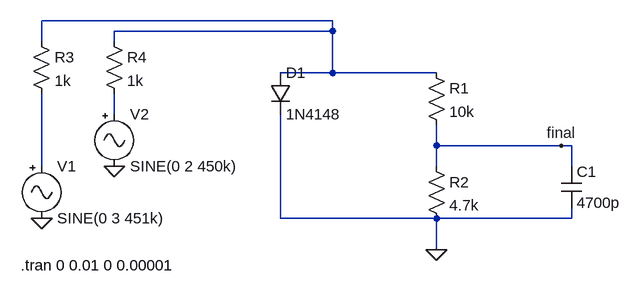
[diagram p0: schematic Draft2.asc]
Draft2.asc, the LTspice schematic file:
Version 4
SHEET 1 880 680
WIRE 80 16 -368 16
WIRE 80 32 80 16
WIRE 80 32 -256 32
WIRE -368 48 -368 16
WIRE -256 48 -256 32
WIRE 80 96 80 32
WIRE 80 96 0 96
WIRE 240 96 80 96
WIRE -256 160 -256 128
WIRE 240 208 240 176
WIRE 432 208 240 208
WIRE 448 208 432 208
WIRE -368 240 -368 128
WIRE 240 240 240 208
WIRE 448 240 448 208
WIRE 0 320 0 160
WIRE 240 320 0 320
WIRE 448 320 448 304
WIRE 448 320 240 320
WIRE 240 368 240 320
FLAG 240 368 0
FLAG 432 208 final
FLAG -368 320 0
FLAG -256 240 0
SYMBOL diode -16 96 R0
SYMATTR InstName D1
SYMATTR Value 1N4148
SYMBOL res 224 80 R0
SYMATTR InstName R1
SYMATTR Value 10k
SYMBOL res 224 224 R0
SYMATTR InstName R2
SYMATTR Value 4.7k
SYMBOL cap 432 240 R0
SYMATTR InstName C1
SYMATTR Value 4700p
SYMBOL Misc\\signal -368 224 R0
WINDOW 123 0 0 Left 0
WINDOW 39 0 0 Left 0
SYMATTR InstName V1
SYMATTR Value SINE(0 3 451k)
SYMBOL Misc\\signal -256 144 R0
WINDOW 123 0 0 Left 0
WINDOW 39 0 0 Left 0
SYMATTR InstName V2
SYMATTR Value SINE(0 2 450k)
SYMBOL res -384 32 R0
SYMATTR InstName R3
SYMATTR Value 1k
SYMBOL res -272 32 R0
SYMATTR InstName R4
SYMATTR Value 1k
TEXT -400 392 Left 2 !.tran 0 0.01 0 0.00001

The netlist it stands for:
* Draft2.asc
D1 N001 0 1N4148
R1 N001 final 10k
R2 final 0 4.7k
C1 final 0 4700p
V1 N003 0 SINE(0 3 451k)
V2 N002 0 SINE(0 2 450k)
R3 N001 N003 1k
R4 N001 N002 1k
.model D D
.lib standard.dio
.tran 0 0.01 0 0.00001
.backanno
.end